# EAGLE design 808_lt (EAGLE 7.1.0)
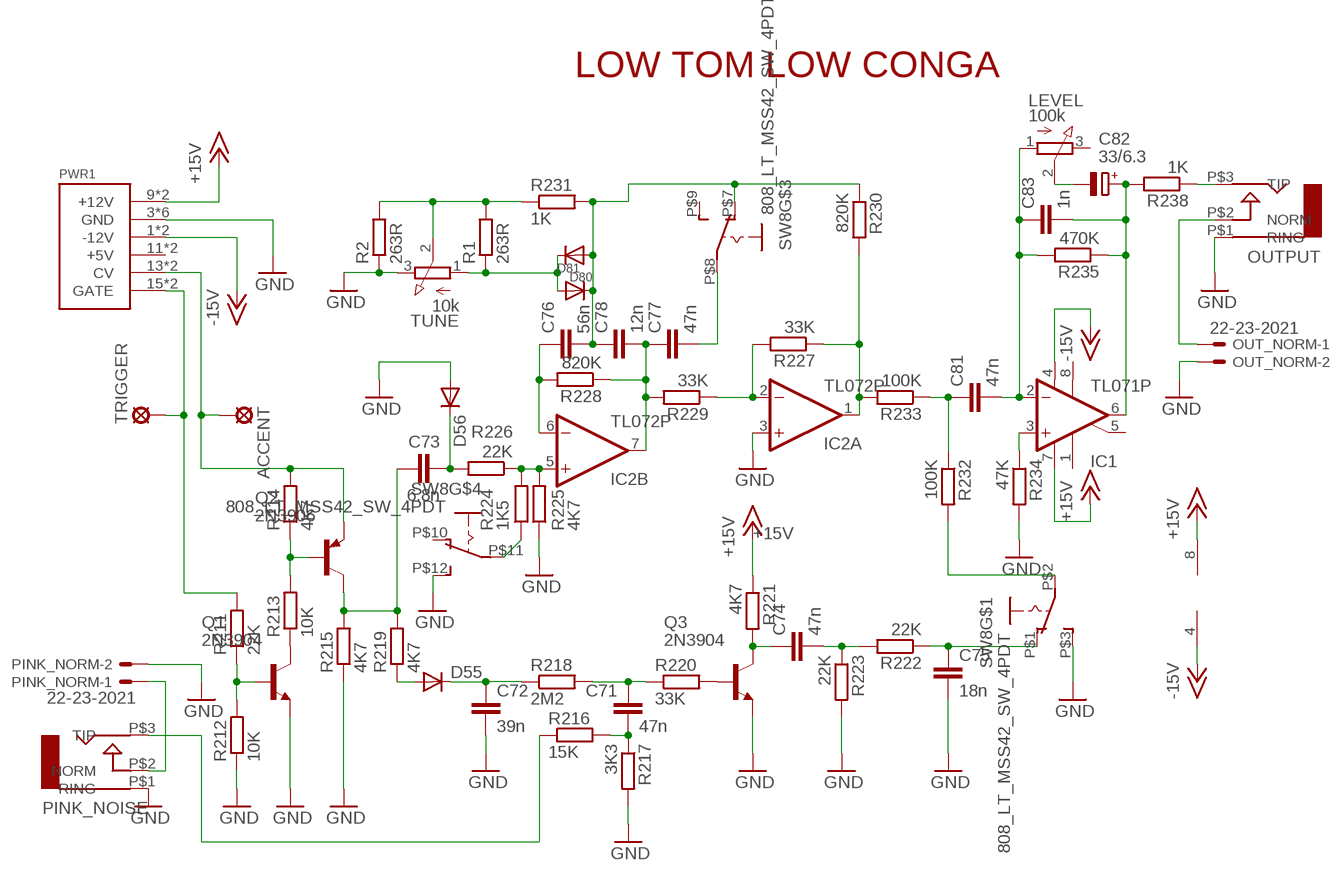
[diagram p0: schematic, sheet 1]

## Parts
ACCENT  LSP10  [LSP10]
C71  47n  C-EU050-024X044  [C050-024X044]
C72  39n  C-EU050-024X044  [C050-024X044]
C73  6.8n  C-EU4MM_PITCH  [C035-030X60]
C74  47n  C-EU050-024X044  [C050-024X044]
C75  18n  C-EU4MM_PITCH  [C035-030X60]
C76  56n  C-EU050-024X044  [C050-024X044]
C77  47n  C-EU050-024X044  [C050-024X044]
C78  12n  C-EU3.5MM_PITCH  [C035-025X75]
C81  47n  C-EU050-024X044  [C050-024X044]
C82  33/6.3  CPOL-EUE2-5  [E2-5]
C83  1n  C-EU3.5MM_PITCH  [C035-025X75]
D55  DIODEDO-1N4148  [DO-1N4148]
D56  DIODEDO-1N4148  [DO-1N4148]
D80  DIODEDO-1N4148  [DO-1N4148]
D81  DIODEDO-1N4148  [DO-1N4148]
IC1  TL071P  [DIL08]
IC2  TL072P  [DIL08]
LEVEL  100k  3RP/1610N  [3RP/1610N]
OUT_NORM  22-23-2021  [22-23-2021]
OUTPUT  AUDIO-JACK  [ERTHENVAR-JACK-90DEG]
PINK_NOISE  AUDIO-JACK  [ERTHENVAR-JACK-90DEG]
PINK_NORM  22-23-2021  [22-23-2021]
PWR1  POWER  [POWER_16]
Q1  2N3904  [TO92]
Q2  2N3906  [TO92]
Q3  2N3904  [TO92]
R1  263R  R-EU_0207/7  [0207/7]
R2  263R  R-EU_0207/7  [0207/7]
R211  22K  R-EU_0207/7  [0207/7]
R212  10K  R-EU_0207/7  [0207/7]
R213  10K  R-EU_0207/7  [0207/7]
R214  4K7  R-EU_0207/7  [0207/7]
R215  4K7  R-EU_0207/7  [0207/7]
R216  15K  R-EU_0207/7  [0207/7]
R217  3K3  R-EU_0207/7  [0207/7]
R218  2M2  R-EU_0207/7  [0207/7]
R219  4K7  R-EU_0207/7  [0207/7]
R220  33K  R-EU_0207/7  [0207/7]
R221  4K7  R-EU_0207/7  [0207/7]
R222  22K  R-EU_0207/7  [0207/7]
R223  22K  R-EU_0207/7  [0207/7]
R224  1K5  R-EU_0207/7  [0207/7]
R225  4K7  R-EU_0207/7  [0207/7]
R226  22K  R-EU_0207/7  [0207/7]
R227  33K  R-EU_0207/7  [0207/7]
R228  820K  R-EU_0207/7  [0207/7]
R229  33K  R-EU_0207/7  [0207/7]
R230  820K  R-EU_0207/7  [0207/7]
R231  1K  R-EU_0207/7  [0207/7]
R232  100K  R-EU_0207/7  [0207/7]
R233  100K  R-EU_0207/7  [0207/7]
R234  47K  R-EU_0207/7  [0207/7]
R235  470K  R-EU_0207/7  [0207/7]
R238  1K  R-EU_0207/7  [0207/7]
SW8  808_LT_MSS42_SW_4PDT  [808_LT_MSS42_SW_SLIDE]
TRIGGER  LSP10  [LSP10]
TUNE  10k  3RP/1610N  [3RP/1610N]

## Nets
+15V: IC1.7(V+) IC2.8(P:V+) PWR1.9(+12V) PWR1.10(+12V) R221.1
-15V: IC1.4(V-) IC2.4(P:V-) PWR1.1(-12V) PWR1.2(-12V)
GND [GND]: C72.2 C75.P$2 D56.A IC2.3(A:+IN) OUT_NORM.2 OUTPUT.P$1(RING) PINK_NOISE.P$1(RING) PINK_NORM.2 PWR1.3(GND) PWR1.4(GND) PWR1.5(GND) PWR1.6(GND) PWR1.7(GND) PWR1.8(GND) Q1.3(E) Q3.3(E) R2.1 R212.1 R215.1 R217.2 R223.2 R225.1 R234.2 SW8.P$3(S) SW8.P$12(S) TUNE.3(E)
LT: PWR1.15(GATE) PWR1.16(GATE) R211.2 TRIGGER.MP
LT_LC_OUT: OUTPUT.P$3(TIP) R238.1
N$1: Q3.2(B) R220.2
N$2: Q1.1(C) R213.1
N$3: OUT_NORM.1 OUTPUT.P$2(NORM)
N$4: PINK_NOISE.P$2(NORM) PINK_NORM.1
N$39: IC2.5(B:+IN) R224.2 R225.2 R226.1
N$109: IC1.3(+IN) R234.1
N$111: R224.1 SW8.P$11(P)
N$241: Q2.2(B) R213.2 R214.1
N$246: Q1.2(B) R211.1 R212.2
N$247: C73.P$1 Q2.1(C) R215.2 R219.2
N$248: D55.A R219.1
N$250: C73.P$2 D56.C R226.2
N$251: C76.2 C78.P$1 D80.A D81.C R230.1 R231.2 SW8.P$7(O)
N$252: C76.1 IC2.6(B:-IN) R228.2
N$253: C77.1 C78.P$2 IC2.7(B:OUT) R228.1 R229.2
N$254: D80.C D81.A R1.1 TUNE.1(A)
N$255: R1.2 R2.2 R231.1 TUNE.2(S)
N$256: IC2.2(A:-IN) R227.2 R229.1
N$257: IC2.1(A:OUT) R227.1 R230.2 R233.2
N$259: C81.1 R232.1 R233.1
N$260: C81.2 C83.P$1 IC1.2(-IN) LEVEL.1(A) R235.2
N$261: C82.- LEVEL.2(S)
N$262: C82.+ C83.P$2 IC1.6(OUT) R235.1 R238.2
N$263: C74.1 Q3.1(C) R221.2
N$264: C75.P$1 R222.1 SW8.P$1(O)
N$266: C71.2 R216.2 R217.1
N$267: C71.1 R218.2 R220.1
N$268: C72.1 D55.C R218.1
N$271: C77.2 SW8.P$8(P)
N$273: R232.2 SW8.P$2(P)
N$274: C74.2 R222.2 R223.1
PN: PINK_NOISE.P$3(TIP) R216.1
TRIG: ACCENT.MP PWR1.13(CV) PWR1.14(CV) Q2.3(E) R214.2
Unconnected: IC1.1(ON1) IC1.5(ON2) IC1.8(OPT) LEVEL.3(E) PWR1.11(+5V) PWR1.12(+5V) SW8.P$4(O) SW8.P$5(P) SW8.P$6(S) SW8.P$9(S) SW8.P$10(O)

## Notes on the sheet
- LOW TOM LOW CONGA

## Library data of the parts
ACCENT TRIGGER = solpad:LSP10: SOLDER PAD drill 1.0 mm, distributor Buerklin, 12H555
C71-C78 C81 C83 = TR808clone:C-EU: CAPACITOR, European symbol Pitch 3mm
C82 = TR808clone:CPOL-EU: POLARIZED CAPACITOR, European symbol
D55 D56 D80 D81 = adafruit:DIODE: Diode SMADIODE - SMA Surface Mount Package 20V 1A Schottky Diode Digikey: 641-1014-6-ND DO-1N4148 - Through Hole Small Current Diode SOD-123 20V 1 A (.5mV Vf) Schottky Diode - Digikey: MBRX120TPMSCT-ND SOD-323 10V 570mA (.38mV Vf, 3ns) Schottky Diode - Digikey: ZLLS410CT-ND SOD-523 30V 30mA Schottky Diode (RB751S-40TE61) - Digikey: RB751S-40TE61CT-ND SOT23-R/W - SOT23 Package (R = Solder Paste/Reflow Ovens, W = Hand-Soldering) BAT54Film 40V 300mA - Digikey: 497-7162-1-ND
IC1 = linear:TL071: OP AMP
IC2 = linear:TL072: OP AMP
LEVEL TUNE = pot:3RP/1610N: 16mm Potentiometer one level Source: http://www.alphapotentiometers.net/html/16mm_pot_2.html
OUT_NORM PINK_NORM = con-molex:22-23-2021: .100" (2.54mm) Center Header - 2 Pin; MF: MOLEX; MPN: 22-23-2021; OC_FARNELL: 1462926; OC_NEWARK: 25C3832
OUTPUT PINK_NOISE = erthenvar:AUDIO-JACK: Switching Mono 3.5mm Audio Jack from Erthenvar.
PWR1 = eurorack:POWER
Q1 Q3 = transistor-npn:2N3904: NPN Transistor
Q2 = transistor-pnp:2N3906: PNP Transistor
R1 R2 R211-R235 R238 = TR808clone:R-EU_: RESISTOR, European symbol
SW8 = 808_lt:808_LT_MSS42_SW_4PDT: MSS42 4PDT switch

## Net classes
0 default: width 0.635 mm, drill 0.254 mm, clearance 0.254 mm
1 GND: width 1.016 mm, drill 1.016 mm, clearance 0.508 mm
2 Power: width 1.016 mm, drill 1.016 mm, clearance 0.508 mm

## Board
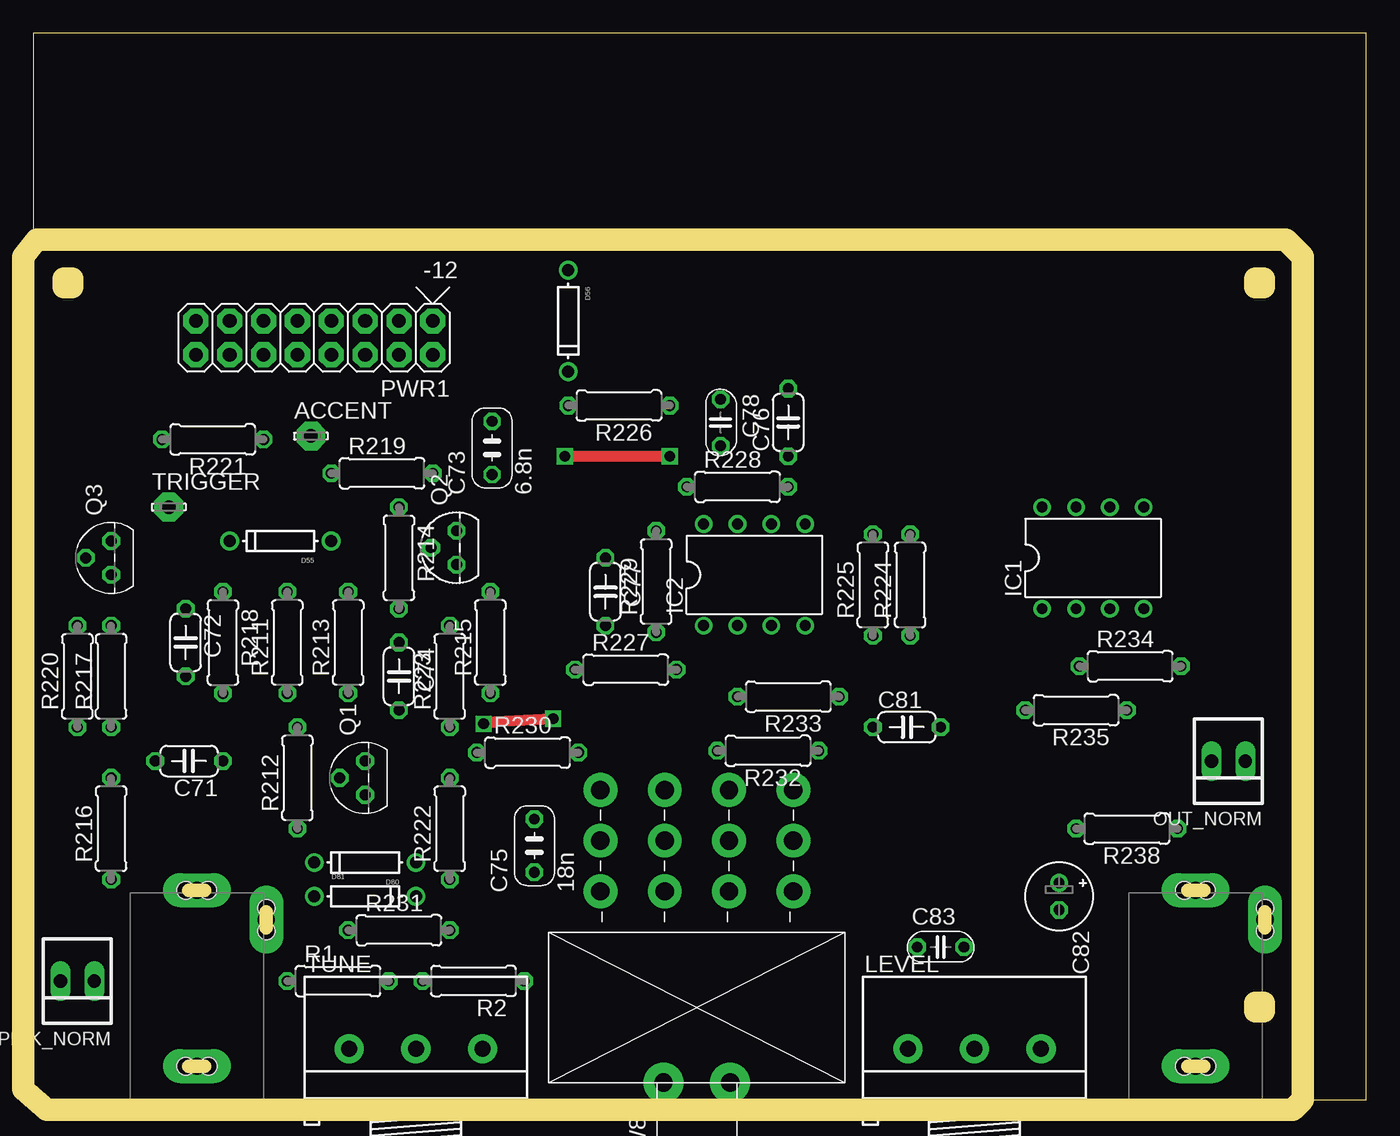
[diagram p1: board, top side]
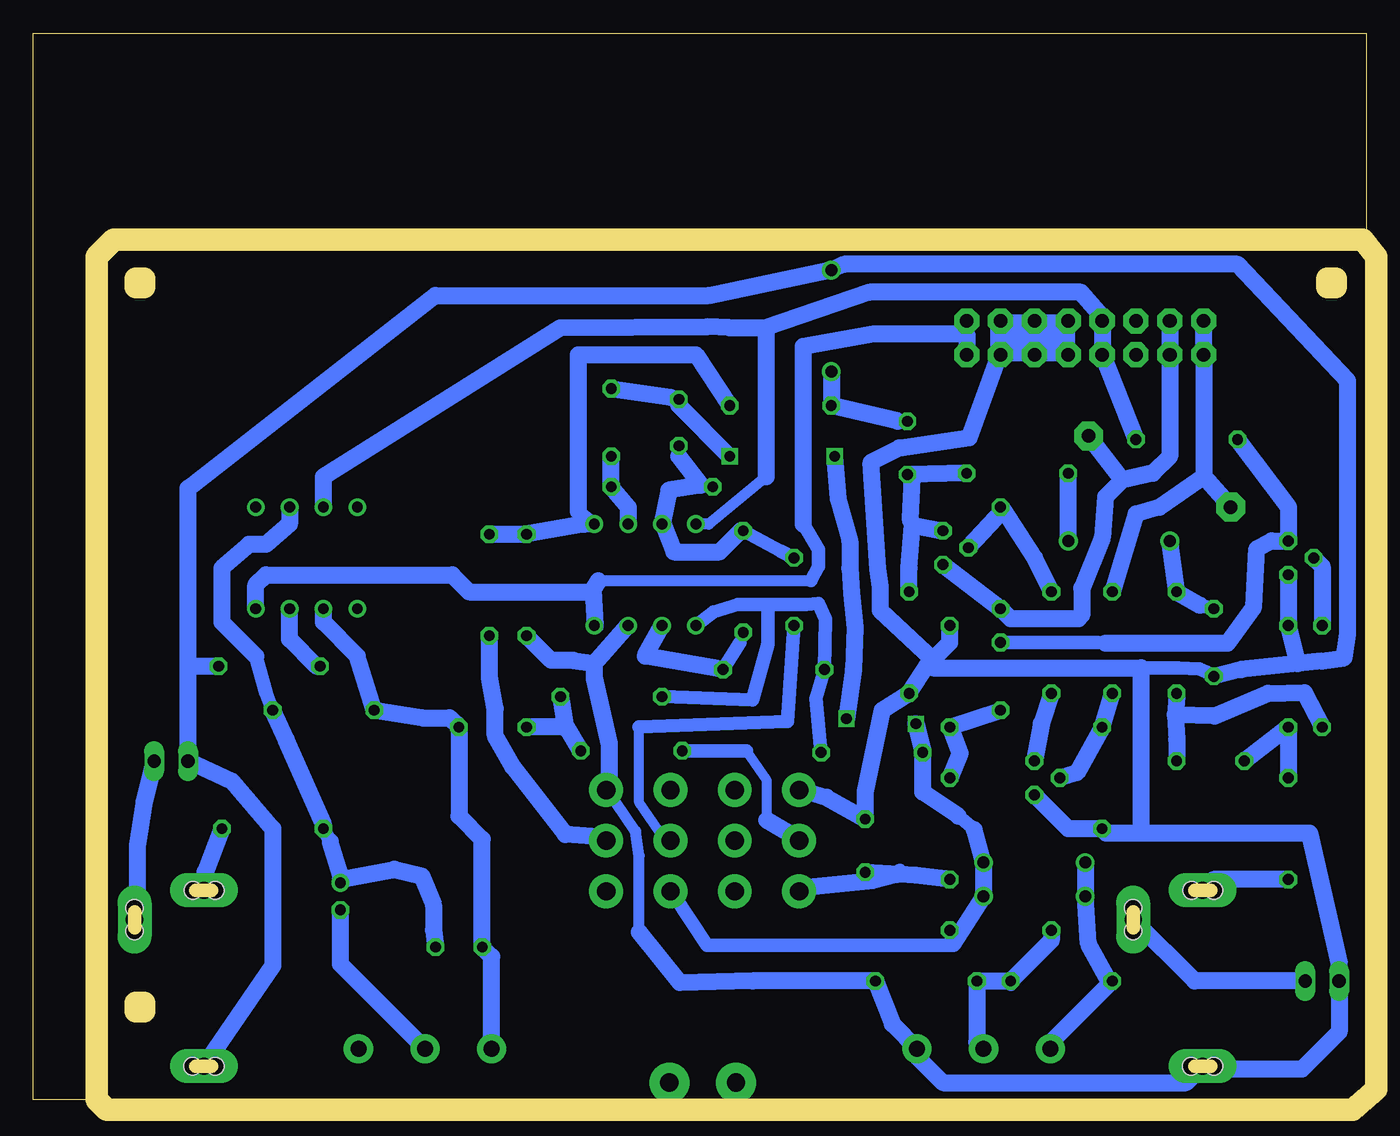
[diagram p2: board, bottom side, seen from below]

Size 100 x 80 mm. Coordinates in mm from the lower left corner, seen from the top.
Outline: 0,0 100,0 100,80 0,80 0,0
Copper layers (1*16): Top 0.035mm / dielectric 1.5mm / Bottom 0.035mm
Design rules "default *": minimum track width 30mil, minimum drill 31mil, track to track 18mil, track to pad 18mil, pad to pad 18mil, via to via 18mil, smd to smd 8mil, copper to edge 0mil, drill to drill 18mil, minimum pad ring 10mil, minimum via ring 8mil, stop-mask expansion 4mil, vias tented up to drill 0mil, thermal gap 10mil
Milling: 20 lines

### Footprints (pad centres in the part's own frame; a part is rotated, then mirrored left to right if it is on the bottom)
LSP10 = drill 1.016 pad 2.159 octagon: MP 0,0
C050-024X044 = drill 0.813 octagon: 1 -2.54,0; 2 2.54,0
C035-030X60 = drill 0.8 octagon: P$1 -2,0; P$2 2,0
C035-025X75 = drill 0.8 octagon: P$1 -1.75,0; P$2 1.75,0
E2-5 = drill 0.813 pad 1.27: + -1.016,0 | drill 0.813 pad 1.27 octagon: - 1.016,0
DO-1N4148 = drill 0.9: A -3.81,0; C 3.81,0
DIL08 = drill 0.813 pad 1.27: 1 -3.81,-3.81; 2 -1.27,-3.81; 3 1.27,-3.81; 4 3.81,-3.81; 5 3.81,3.81; 6 1.27,3.81; 7 -1.27,3.81; 8 -3.81,3.81
3RP/1610N = drill 1.2 pad 2.184: 1 -5,0; 2 0,0; 3 5,0
22-23-2021 = drill 1 long: 1 -1.27,0; 2 1.27,0
ERTHENVAR-JACK-90DEG = drill 1.3 pad 2.54 long: P$1 5,-2.5; P$2 -0.2,-13.5; P$3 5,-15.7 | hole 1.3: 5.842,-2.489; 4.14,-2.489; -0.203,-12.649; -0.203,-14.351; 5.842,-15.697; 4.166,-15.697
POWER_16 = drill 1.016 pad 1.88 octagon: 1 -6.35,-1.27; 2 -6.35,1.27; 3 -3.81,-1.27; 4 -3.81,1.27; 5 -1.27,-1.27; 6 -1.27,1.27; 7 1.27,-1.27; 8 1.27,1.27; 9 3.81,-1.27; 10 3.81,1.27; 11 6.35,-1.27; 12 6.35,1.27; 13 8.89,-1.27; 14 8.89,1.27; 15 11.43,-1.27; 16 11.43,1.27
TO92 = drill 0.813 octagon: 1 1.27,0; 2 0,1.905; 3 -1.27,0
0207/7 = drill 0.813 octagon: 1 -3.81,0; 2 3.81,0
808_LT_MSS42_SW_SLIDE = drill 1.372 pad 2.54: P$1 -7.239,14.351; P$2 -7.239,18.151; P$3 -7.239,21.951; P$4 -2.413,14.351; P$5 -2.413,18.151; P$6 -2.413,21.951; P$7 2.413,14.351; P$8 2.413,18.151; P$9 2.413,21.951; P$10 7.239,14.351; P$11 7.239,18.151; P$12 7.239,21.951 | drill 1.372 pad 3: PG$1 2.5,0; PG$2 -2.5,0

### Placement (x,y rotation side)
ACCENT  20.83,49.78 0 top
C71  11.68,25.4 180 top
C72  11.43,34.29 270 top
C73  34.42,48.9 90 top
C74  27.43,31.75 270 top
C75  37.59,19.05 90 top
C76  56.64,50.8 90 top
C77  42.93,38.1 270 top
C78  51.56,50.8 270 top
C81  65.53,27.94 0 top
C82  76.96,15.24 270 top
C83  68.07,11.43 0 top
D55  18.54,41.91 180 top
D56  40.13,58.42 270 top
D80  24.89,17.78 180 top
D81  24.89,15.24 0 top
IC1  79.5,40.64 0 top
IC2  54.1,39.37 0 top
LEVEL  70.61,3.81 0 top
OUT_NORM  89.66,25.4 180 top
OUTPUT  92.2,0 180 top
PINK_NOISE  17.27,0 180 top
PINK_NORM  3.3,8.89 180 top
PWR1  23.62,57.15 180 top
Q1  24.89,24.13 90 top
Q2  31.75,41.4 90 top
Q3  5.84,40.64 90 top
R1  22.86,8.89 0 top
R2  33.02,8.89 180 top
R211  19.05,34.29 90 top
R212  19.81,24.13 90 top
R213  23.62,34.29 90 top
R214  27.43,40.64 270 top
R215  34.29,34.29 90 top
R216  5.84,20.32 90 top
R217  5.84,31.75 90 top
R218  14.22,34.29 270 top
R219  26.16,46.99 0 top
R220  3.3,31.75 90 top
R221  13.46,49.53 180 top
R222  31.24,20.32 90 top
R223  31.24,31.75 90 top
R224  65.79,38.61 90 top
R225  62.99,38.61 90 top
R226  43.94,52.07 180 top
R227  44.45,32.26 0 top
R228  52.83,45.97 0 top
R229  46.74,38.86 90 top
R230  37.08,26.04 0 top
R231  27.43,12.7 0 top
R232  55.12,26.16 180 top
R233  56.64,30.23 180 top
R234  82.3,32.51 0 top
R235  78.23,29.21 180 top
R238  82.04,20.32 180 top
SW8  49.78,1.27 0 top
TRIGGER  10.16,44.45 0 top
TUNE  28.7,3.81 0 top

### Tracks (layer width: path | path; a pad name or v marks a point on that pad's centre or on a via)
+15V
  Bottom 0.762: PWR1.9 19.81,58.74
  Bottom 0.813: IC2.8 49.34,43.18 45.02,46.74
  Bottom 1.27: R221.1 PWR1.10 PWR1.9 | 45.02,57.91 45.02,46.74 | 45.02,57.91 37.27,60.58 21.4,60.58 19.81,58.74 | 45.02,57.91 47.75,57.91 49.47,57.98 60.45,57.91 78.23,46.74 IC1.7
-15V
  Bottom 0.762: PWR1.1 29.97,57.47 | 57.85,35.56 IC2.4
  Bottom 0.813: 57.59,38.92 41.66,38.92
  Bottom 1.016: 58.01,38.26 58,38.2 58.1,38.1 | 42.23,43.18 41.08,41.27 41.08,40.01 41.66,38.92
  Bottom 1.27: PWR1.2 29.97,57.47 36.96,57.47 42.23,56.52 42.23,43.18 | 58,38.2 57.85,35.56 | 57.59,38.92 58.01,38.26 | IC1.4 83.31,38.61 82.55,39.37 68.58,39.37 67.31,38.1 58.1,38.1
GND  (1 unrouted)
  Bottom 0.813: 57.02,23.37 54.8,20.13 54.55,18.29 54.55,12.57
  Bottom 1.016: 56.77,23.75 SW8.P$12 57.02,23.37 | 2.03,10.16 PINK_NORM.2 | 19.49,20 R212.1 | PWR1.3 PWR1.5 PWR1.7 PWR1.8 PWR1.6 PWR1.4 27.75,55.56 27.75,55.24 | 32.51,33.02 32.83,32.7 32.51,32.38 | 37.59,20.95 C75.P$2 | 42.23,23.18 SW8.P$3 | 16.89,32.38 14.1,32.38 12.51,32.32 12,32.07 C72.2 | TUNE.3 33.7,3.22 | 11.94,2.29 12.19,2.54
  Bottom 1.27: 57.91,32.7 57.91,31.62 56.77,26.67 56.77,23.75 | 57.91,32.7 IC2.3 | 57.91,32.7 59.5,32.96 61.15,32.96 R225.1 | 2.03,10.16 4.25,20 16.89,20 | 19.49,20 16.89,20 | 54.55,12.57 51.5,8.76 46.04,8.89 R2.1 35.56,5.67 TUNE.3 | 88.39,32.51 OUT_NORM.2 85.09,23.88 82.04,20.32 82.04,10.04 OUTPUT.P$1 | 88.39,32.51 88.39,45.85 69.85,60.33 49.34,60.33 40.32,62.23 D56.A 39.18,62.67 9.65,62.67 1.4,53.91 1.4,34.92 1.65,33.15 3.3,32.89 5.14,32.7 | Q3.3 R217.2 5.14,32.7 | C72.2 9.4,32.26 5.14,32.7 | R223.2 31.24,34.29 32.51,33.02 36.45,36.7 36.45,38.48 36.64,39.81 37.15,47.82 35.05,48.9 29.78,49.66 27.75,55.24 | 32.83,32.7 R215.1 36.32,29.21 37.59,23.08 C75.P$2 40.48,22.67 42.23,23.18 | 32.51,32.38 16.89,32.38 16.89,20 | R234.2 88.39,32.51 | 33.7,3.22 31.75,1.27 13.5,1.27 PINK_NOISE.P$1 | R212.1 22.35,20.32 Q1.3 | PINK_NORM.2 2.03,5.08 4.83,2.29 11.94,2.29
LT
  Bottom 1.27: 12.19,46.74 15.49,44.45 17.27,43.94 R211.2 | 12.19,46.74 PWR1.16 PWR1.15 | 12.19,46.74 TRIGGER.MP
LT_LC_OUT
  Bottom 1.016: 87.12,17.05 OUTPUT.P$3
  Bottom 1.27: R238.1 87.12,17.05
N$1
  Bottom 1.27: R220.2 3.3,40.01 Q3.2
N$2
  Bottom 1.27: Q1.1 24.38,28.19 R213.1
N$3
  Bottom 0.813: 92.2,13.7 OUTPUT.P$2
  Bottom 1.27: OUT_NORM.1 91.69,22.35 92.2,19.05 92.2,13.7
N$4
  Bottom 1.27: PINK_NORM.1 12.86,8.89 PINK_NOISE.P$2
N$39
  Bottom 1.016: 59.12,44.13 IC2.5
  Bottom 1.27: R226.1 50.29,55.88 59.12,55.88 59.12,44.13 | IC2.5 58.67,43.18 R225.2 R224.2
N$109
  Bottom 1.016: R234.1 78.74,32.51
  Bottom 1.27: 78.74,32.51 80.77,34.54 IC1.3
N$111
  Bottom 0.762: 57.09,19.68 SW8.P$11
  Bottom 1.27: R224.1 65.79,31.69 65.34,29.34 65.34,27.3 64.01,24.96 60.07,19.88 57.09,19.68
N$241
  Bottom 0.762: R214.1 27.21,44.23
  Bottom 0.813: 27.24,44.2 27.21,44.23
  Bottom 1.27: R213.2 24.89,40.64 27.21,44.23 | 27.24,44.2 Q2.2
N$246
  Bottom 1.27: Q1.2 21.72,24.51 R212.2 R211.1
N$247
  Bottom 0.762: 34.1,46.67 C73.P$1
  Bottom 1.27: 34.04,43.12 34.29,39.88 R215.2 | R219.2 C73.P$1 | 34.04,43.12 Q2.1 | 34.04,43.12 34.23,43.56 34.1,46.67
N$248
  Bottom 1.27: D55.A R219.1
N$250
  Bottom 1.016: C73.P$2 35.15,50.9
  Bottom 1.27: 35.15,50.9 R226.2 D56.C
N$251  (via drill 0.8)
  Top 0.813: v47.75,48.26 v39.88,48.26 | v38.99,28.57 34.67,28.32 v33.78,28.19
  Bottom 0.762: 30.99,11.68 31.24,11.56 R231.2 | 51.94,15.3 52.26,15.3 SW8.P$7 | 52.2,52.7 51.56,52.7 C78.P$1
  Bottom 1.016: 29.4,20.26 30.61,21.27 | 51.94,15.3 49.47,11.56 31.24,11.56 | C78.P$1 51.56,52.07
  Bottom 1.27: 30.99,11.68 D81.C D80.A 29.4,20.26 | 30.61,21.27 33.27,23.05 R230.1 v33.78,28.19 | C76.2 52.2,52.7 | 51.56,52.07 v47.75,48.26 | v39.88,48.26 39.62,45.09 38.73,41.91 38.73,39.88 38.61,37.97 38.35,35.43 38.48,32.26 v38.99,28.57
N$252
  Bottom 1.27: IC2.6 55.37,44.45 R228.2 C76.1
N$253
  Bottom 0.762: 46.93,42.67 R229.2 | 52.77,43.18 IC2.7
  Bottom 0.813: R228.1 49.91,46.1
  Bottom 1.016: C77.1 43.94,41.15 R229.2 | 51.56,48.26 C78.P$2
  Bottom 1.27: 51.56,48.26 49.91,46.1 52.32,45.72 IC2.7 | 46.93,42.67 48.51,41.08 51.94,41.08 52.77,43.18
N$254
  Bottom 1.27: D80.C D81.A 20.83,11.68 19.3,8.89 R1.1 23.7,4.24 TUNE.1
N$255
  Bottom 1.016: 26.67,8.64 R1.2
  Bottom 1.27: R231.1 23.62,11.94 R1.2 R2.2 29.21,4.32 TUNE.2
N$256
  Bottom 0.762: 46.99,34.29 R229.1
  Bottom 1.016: R227.2 46.99,34.29
  Bottom 1.27: R227.2 54.1,33.27 IC2.2
N$257
  Bottom 1.016: R230.2 41.27,30.1 R227.1 40.58,36.07 41.08,37.21 42.04,37.15 44.9,37.15 | IC2.1 48.96,36.58 47.12,37.15 44.9,37.15 | R233.2 46.04,29.97 44.9,34.16 44.9,37.15
N$259
  Bottom 0.762: 60.26,27.94 60.1,28.1
  Bottom 1.27: R233.1 60.1,28.1 R232.1 | 60.26,27.94 C81.1
N$260
  Bottom 0.762: 65.53,3.81 LEVEL.1
  Bottom 1.27: IC1.2 78.23,35.81 75.69,33.27 R235.2 70.87,28.64 68.77,28.64 C81.2 68.07,21.28 66.32,19.53 C83.P$1 65.61,10.72 LEVEL.1
N$261
  Bottom 1.27: C82.- 76.96,10.16 LEVEL.2
N$262
  Bottom 0.762: 76.96,16.83 76.96,16.51 C82.+ | 78.23,20.64 R238.2
  Bottom 1.016: 77.72,19.37 R238.2 | 83.31,33.27 82.55,30.48 R235.1
  Bottom 1.27: 76.96,16.51 72.9,17.27 70.87,16.76 69.98,14.61 69.98,12.7 C83.P$2 | 76.96,16.83 77.72,19.37 | R235.1 81.03,26.99 78.23,20.64 | IC1.6 80.77,43.18 82.55,41.66 83.82,41.66 85.85,39.88 85.85,35.81 83.31,33.27
N$263
  Bottom 0.762: 19.81,34.29 20.13,34.29
  Bottom 1.016: 20.13,34.29 C74.1 | 19.56,34.23 19.81,34.29
  Bottom 1.27: R221.2 5.84,44.45 Q3.1 7.11,41.91 8.19,41.34 8.45,36.96 10.41,34.23 19.56,34.23
N$264
  Bottom 0.762: R222.1 31.56,16.57 | 35.24,16.89 34.99,17.21 | 35.05,17.14 C75.P$1
  Bottom 1.016: 34.99,17.21 35.05,17.14 | SW8.P$1 41.85,15.94
  Bottom 1.27: 31.56,16.57 33.78,16.83 C75.P$1 | 35.24,16.89 36.96,16.45 41.85,15.94
N$266
  Bottom 1.27: R216.2 R217.1 C71.2
N$267
  Bottom 0.762: R218.2 14.22,30.29
  Bottom 1.27: C71.1 14.22,26.99 14.32,28.86 | 14.22,30.29 14.32,28.86 | R220.1 4.64,30.54 7.37,30.48 11.37,28.77 14.32,28.86
N$268
  Bottom 1.016: 12.45,37.08 C72.1
  Bottom 1.27: 12.45,37.08 R218.1 D55.C
N$271
  Bottom 0.762: 54.55,27.94 54.55,22.29 52.32,19.05 52.32,19.43 SW8.P$8
  Bottom 1.016: C77.2 43.43,28.38 54.55,27.94
N$273
  Bottom 0.762: 46.48,26.16 44.96,23.94 44.96,20.95 | 42.8,19.68 SW8.P$2
  Bottom 1.016: 46.48,26.16 R232.2
  Bottom 1.27: 42.8,19.68 44.96,20.95
N$274
  Bottom 1.27: R222.2 30.48,25.97 R223.1 C74.2
PN
  Bottom 1.27: R216.1 11.46,16.51 PINK_NOISE.P$3
TRIG
  Bottom 1.016: 21.34,36.32 21.59,36.07
  Bottom 1.27: PWR1.13 PWR1.14 14.73,48.26 16,46.99 18.29,46.48 | Q2.3 R214.2 26.67,36.07 21.59,36.07 | 18.29,46.48 19.56,45.21 19.81,42.16 21.34,38.35 21.34,36.32 | 18.29,46.48 ACCENT.MP
(copper drawn outside any net)
  shapes: Bottom area x1